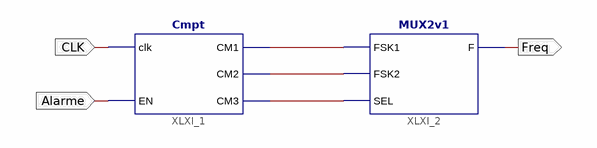
[diagram p0: schematic sheet 1]
// Xilinx ISE schematic son.sch (spartan3e) as structural Verilog: 2 symbols, 3 ports
module son (
  input  CLK,
  input  Alarme,
  output Freq
);

  wire XLXN_1, XLXN_2, XLXN_3;

  Cmpt XLXI_1 (.clk(CLK), .EN(Alarme), .CM1(XLXN_1), .CM2(XLXN_2), .CM3(XLXN_3));
  MUX2v1 XLXI_2 (.FSK1(XLXN_1), .FSK2(XLXN_2), .SEL(XLXN_3), .F(Freq));
endmodule
